# EAGLE design billdetect_ringboard (EAGLE 5.11)
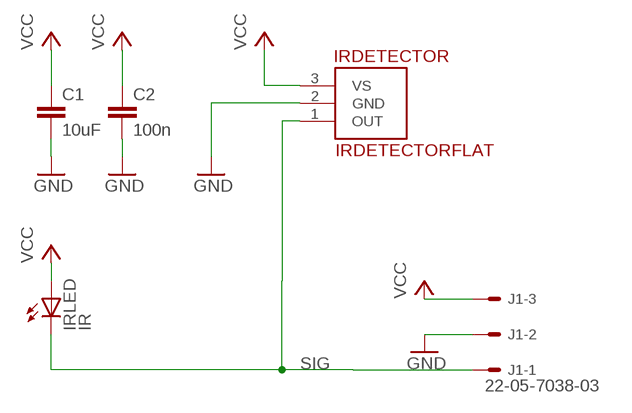
[diagram p0: schematic, sheet 1]

## Parts
C1  10uF  CAP0805  [0805]
C2  100n  CAP0805  [0805]
IRDETECTOR  IRDETECTORFLAT  [TSOP-3PIN-2.54MM-FLAT]
IRLED  IR  LED5MM  [LED5MM]
J1  22-05-7038-03  [7395-03]

## Nets
GND: C1.2 C2.2 IRDETECTOR.2(GND) J1.2
SIG: IRDETECTOR.1(OUT) IRLED.K(C) J1.1
VCC: C1.1 C2.1 IRDETECTOR.3(VS) IRLED.A J1.3

## Library data of the parts
C1 C2 = SparkFun-20110517:CAP: Capacitor Standard 0603 ceramic capacitor, and 0.1" leaded capacitor.
IRDETECTOR = todstuff:IRDETECTOR: Vishay TSOP348.., TSOP344.. IR receiver modules CARRIER FREQUENCY STD (AGC2,AGC8) NOISY ENV(AGC4) 30 kHz TSOP34830 TSOP34430 33 kHz TSOP34833 TSOP34433 36 kHz TSOP34836 TSOP34436 38 kHz TSOP34838 TSOP34438 40 kHz TSOP34840 TSOP34440 56 kHz TSOP34856 TSOP34456
IRLED = SparkFun-20090330:LED: LEDs Standard schematic elements and footprints for 5mm, 3mm, 1206, and 0603 sized LEDs. 5mm - Spark Fun Electronics SKU : COM-00529 (and others)
J1 = con-molex:22-?-03: CONNECTOR wire to board 2.54 mm (.1 inch) pitch header; OC_FARNELL: unknown; OC_NEWARK: unknown

## Board
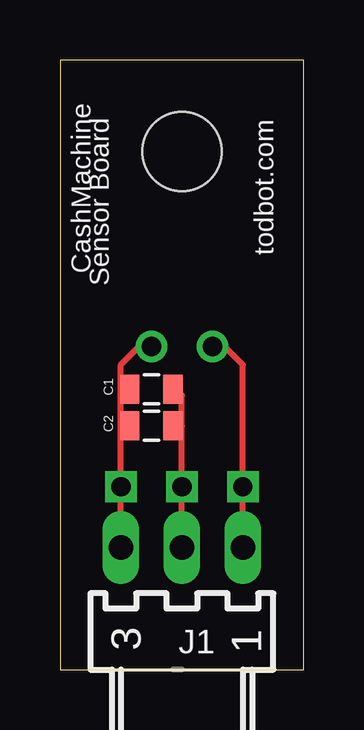
[diagram p1: board, top side]
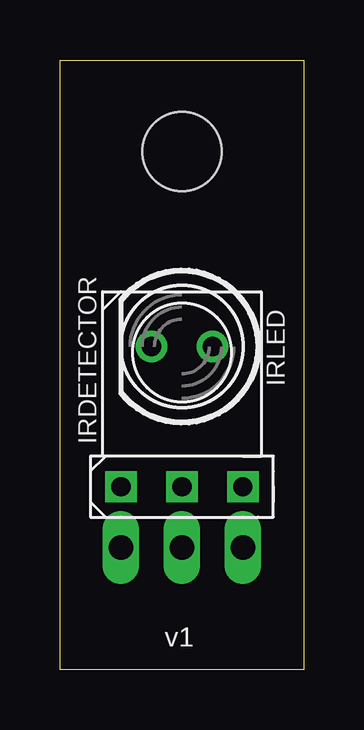
[diagram p2: board, bottom side, seen from below]

Size 10.16 x 25.4 mm. Coordinates in mm from the lower left corner, seen from the top.
Outline: 0,0 10.16,0 10.16,25.4 0,25.4 0,0
Copper layers (1*16): Top 0.035mm / dielectric 1.5mm / Bottom 0.035mm
Design rules "default": minimum track width 10mil, minimum drill 24mil, track to track 8mil, track to pad 8mil, pad to pad 8mil, via to via 8mil, smd to smd 8mil, copper to edge 40mil, drill to drill 8mil, minimum pad ring 10mil, minimum via ring 8mil, stop-mask expansion 4mil, vias tented up to drill 0mil, thermal gap 10mil

### Footprints (pad centres in the part's own frame; a part is rotated, then mirrored left to right if it is on the bottom)
0805 = smd 0.8 x 1.2: 1 -0.9,0; 2 0.9,0
TSOP-3PIN-2.54MM-FLAT = drill 0.8 square: 1 5.08,0; 2 2.54,0; 3 0,0
LED5MM = drill 0.813 round: A -1.27,0; K 1.27,0
7395-03 = drill 1.016 long: 1 2.54,0; 2 0,0; 3 -2.54,0
STAND-OFF = hole 3.302: 0,0

### Placement (x,y rotation side)
C1  3.81,10.16 0 top
C2  3.81,11.68 0 top
IRDETECTOR  2.54,7.62 180 bottom
IRLED  5.08,13.46 180 bottom
J1  5.08,5.08 0 top
U$1  [STAND-OFF]  5.08,21.59 0 top

### Tracks (layer width: path | path; a pad name or v marks a point on that pad's centre or on a via)
GND
  Top 0.254: 5.08,10.16 5.08,11.43 C2.2 | 5.08,10.16 C1.2 5.08,10.16 | 5.08,10.16 IRDETECTOR.2 J1.2
SIG
  Top 0.254: J1.1 IRDETECTOR.1 7.62,12.7 6.35,13.97 IRLED.K
VCC
  Top 0.254: 2.54,10.16 2.54,11.43 | 2.54,10.16 C1.1 2.54,10.16 | 2.54,11.43 C2.1 2.54,11.43 | 2.54,10.16 IRDETECTOR.3 J1.3 | 2.54,11.43 2.54,12.7 3.81,13.97 IRLED.A

### Text on the board
tPlace: todbot.com
bPlace: v1
tNames: CashMachine | Sensor Board